# Altium schematic sheet AFE_BQ-Chip.SchDoc
size A4
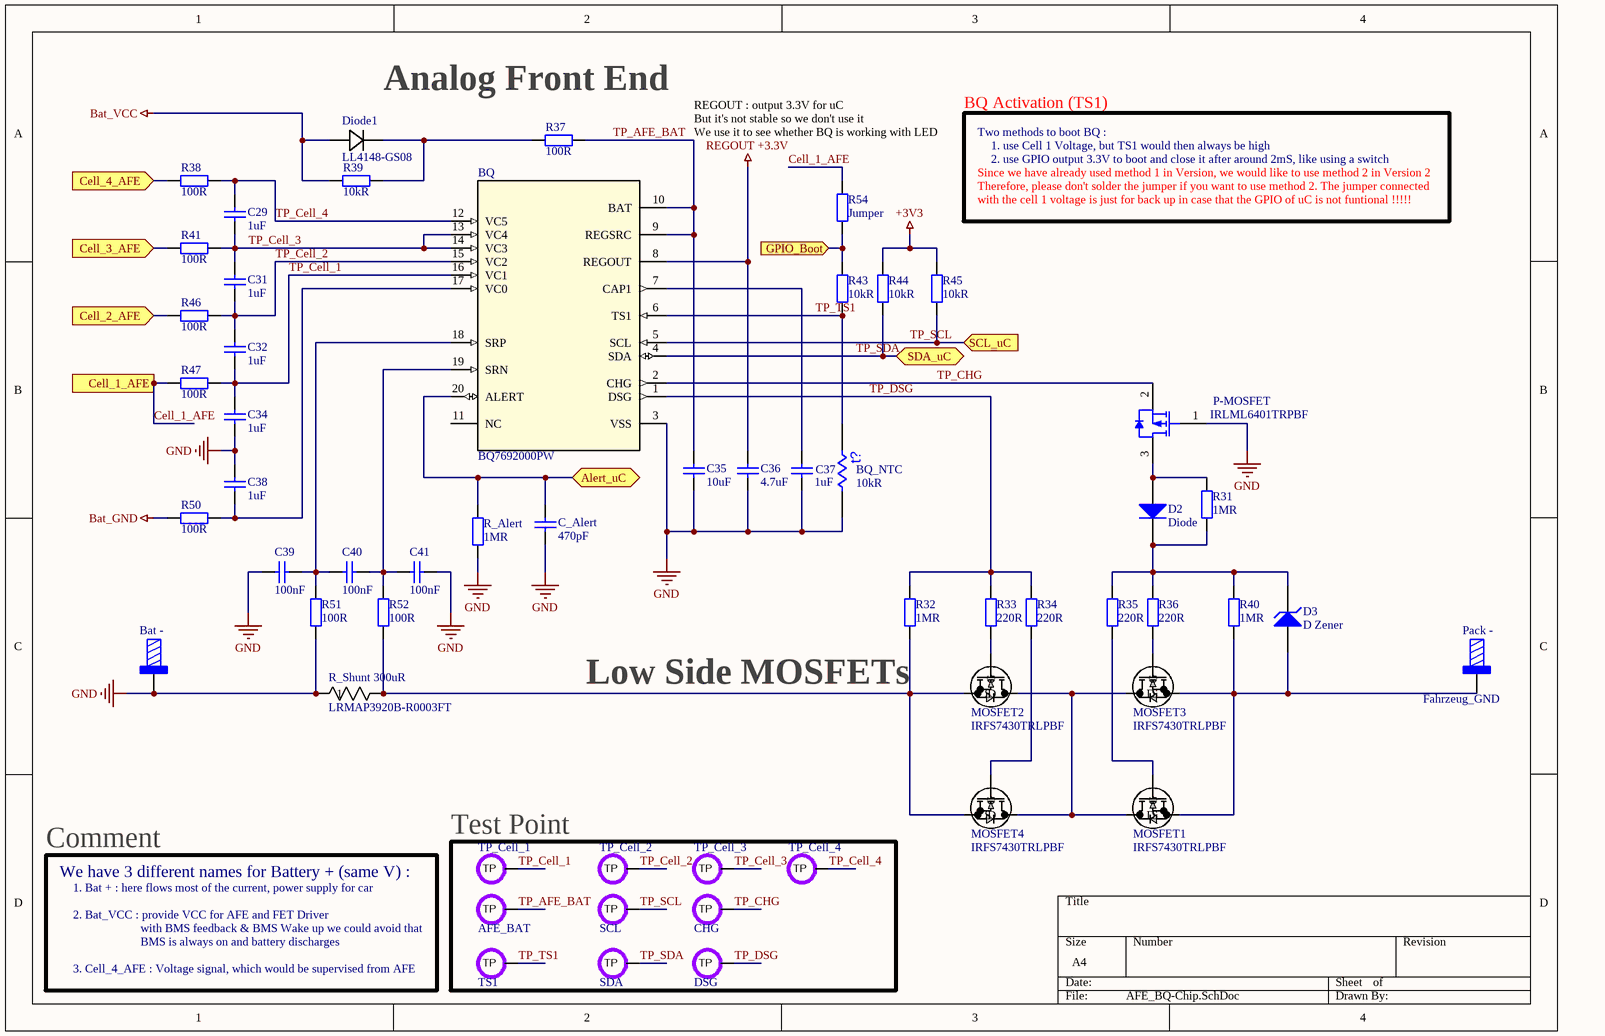
[diagram p0: AFE_BQ-Chip.SchDoc]

## Parts
AFE_BAT  TP_1  [Test point]  (value not drawn)  (no BOM)
Bat_-  M4x6mm  [7461096_for chemical surfaces]  (value not drawn)
BQ  BQ7692000PW  [PW0020A_N]
BQ_NTC  10kR  [J1-0603]
C29  1uF  [1608[0603]]
C31  1uF  [1608[0603]]
C32  1uF  [1608[0603]]
C34  1uF  [1608[0603]]
C35  10uF  [1608[0603]]
C36  4.7uF  [1608[0603]]
C37  1uF  [1608[0603]]
C38  1uF  [1608[0603]]
C39  100nF  [1608[0603]]
C40  100nF  [1608[0603]]
C41  100nF  [1608[0603]]
C_Alert  470pF  [1608[0603]]
CHG  TP_1  [Test point]  (value not drawn)  (no BOM)
D2  Diode  [SMB]
D3  D Zener  [SMB]
Diode1  LL4148-GS08  [MELF_SOD-80_VIS]
DSG  TP_1  [Test point]  (value not drawn)  (no BOM)
MOSFET1  IRFS7430TRLPBF  [D2PAK_TO-263AB_INF-M]
MOSFET2  IRFS7430TRLPBF  [D2PAK_TO-263AB_INF-M]
MOSFET3  IRFS7430TRLPBF  [D2PAK_TO-263AB_INF-M]
MOSFET4  IRFS7430TRLPBF  [D2PAK_TO-263AB_INF-M]
P-MOSFET  IRLML6401TRPBF  [INTR-SOT-23-3_V]
Pack_-  Fahrzeug_GND  [7461096_for chemical surfaces]
R31  1MR  [J1-0603]
R32  1MR  [J1-0603]
R33  220R  [J1-0603]
R34  220R  [J1-0603]
R35  220R  [J1-0603]
R36  220R  [J1-0603]
R37  100R  [J1-0603]
R38  100R  [J1-0603]
R39  10kR  [J1-0603]
R40  1MR  [J1-0603]
R41  100R  [J1-0603]
R43  10kR  [J1-0603]
R44  10kR  [J1-0603]
R45  10kR  [J1-0603]
R46  100R  [J1-0603]
R47  100R  [J1-0603]
R50  100R  [J1-0603]
R51  100R  [J1-0603]
R52  100R  [J1-0603]
R54  Jumper  [J1-0603]
R_Alert  1MR  [J1-0603]
R_Shunt_300uR  LRMAP3920B-R0003FT  [RES_LRMAP3920B-R0003FT_WEL]
SCL  TP_1  [Test point]  (value not drawn)  (no BOM)
SDA  TP_1  [Test point]  (value not drawn)  (no BOM)
TP_Cell_1  TP_1  [Test point]  (value not drawn)  (no BOM)
TP_Cell_2  TP_1  [Test point]  (value not drawn)  (no BOM)
TP_Cell_3  TP_1  [Test point]  (value not drawn)  (no BOM)
TP_Cell_4  TP_1  [Test point]  (value not drawn)  (no BOM)
TS1  TP_1  [Test point]  (value not drawn)  (no BOM)

## Blocks framed on the sheet
Test Point: AFE_BAT CHG DSG SCL SDA TP_Cell_1-TP_Cell_4 TS1

## Ports
Alert_uC (bidir), Cell_1_AFE (in), Cell_2_AFE (in), Cell_3_AFE (in), Cell_4_AFE (in), GPIO_Boot (in), SCL_uC (in), SDA_uC (bidir)

## Nets
+3V3: R44.1 R45.1
Bat_GND: R50.2
Bat_VCC: Diode1.2 R39.2
GND: Bat_-.1 BQ.3(VSS) BQ_NTC.2 C34.1 C35.2 C36.2 C37.2 C38.1 C39.2 C41.1 C_Alert.2 P-MOSFET.1(GATE) R51.2 R_Alert.2 R_Shunt_300uR.1
REGOUT +3.3V: BQ.8(REGOUT) C36.1
Alert_uC: BQ.20(ALERT) C_Alert.1 R_Alert.1 ; port Alert_uC
Cell_1_AFE: R47.2 R54.2 ; port Cell_1_AFE
Cell_2_AFE: R46.2 ; port Cell_2_AFE
Cell_3_AFE: R41.2 ; port Cell_3_AFE
Cell_4_AFE: R38.2 ; port Cell_4_AFE
GPIO_Boot: R43.1 R54.1 ; port GPIO_Boot
TP_AFE_BAT: AFE_BAT.1(TP) BQ.9(REGSRC) BQ.10(BAT) C35.1 R37.1
TP_Cell_1: BQ.16(VC1) C32.1 C34.2 R47.1 TP_Cell_1.1(TP)
TP_Cell_2: BQ.15(VC2) C31.1 C32.2 R46.1 TP_Cell_2.1(TP)
TP_Cell_3: BQ.13(VC4) BQ.14(VC3) C29.1 C31.2 R41.1 TP_Cell_3.1(TP)
TP_Cell_4: BQ.12(VC5) C29.2 R38.1 TP_Cell_4.1(TP)
TP_CHG: BQ.2(CHG) CHG.1(TP) P-MOSFET.2(SOURCE)
TP_DSG: BQ.1(DSG) DSG.1(TP) R32.1 R33.1 R34.1
TP_SCL: BQ.5(SCL) R45.2 SCL.1(TP) ; port SCL_uC
TP_SDA: BQ.4(SDA) R44.2 SDA.1(TP) ; port SDA_uC
TP_TS1: BQ.6(TS1) BQ_NTC.1 R43.2 TS1.1(TP)
NetBQ_7: BQ.7(CAP1) C37.1
NetBQ_17: BQ.17(VC0) C38.2 R50.1
NetBQ_18: BQ.18(SRP) C39.1 C40.2 R51.1
NetBQ_19: BQ.19(SRN) C40.1 C41.2 R52.1
NetD2_1: D2.1(A) P-MOSFET.3(DRAIN) R31.1
NetD2_2: D2.2(K) D3.2(K) R31.2 R35.1 R36.1 R40.1
NetD3_1: D3.1(A) MOSFET1.3(S) MOSFET3.3(S) Pack_-.1 R40.2
NetDiode1_1: Diode1.1 R37.2 R39.1
NetMOSFET1_1: MOSFET1.1(G) R35.2
NetMOSFET1_2: MOSFET1.2(D) MOSFET2.2(D) MOSFET3.2(D) MOSFET4.2(D)
NetMOSFET2_1: MOSFET2.1(G) R33.2
NetMOSFET2_3: MOSFET2.3(S) MOSFET4.3(S) R32.2 R52.2 R_Shunt_300uR.2
NetMOSFET3_1: MOSFET3.1(G) R36.2
NetMOSFET4_1: MOSFET4.1(G) R34.2

Not connected (* = marked no-connect by the designer): BQ 11(NC)

## Notes on the sheet
- Analog Front End
- REGOUT : output 3.3V for uC
- BQ Activation (TS1)
- But it's not stable so we don't use it
- We use it to see whether BQ is working with LED
- Two methods to boot BQ :
- Since we have already used method 1 in Version, we would like to use method 2 in Version 2
- 1. use Cell 1 Voltage, but TS1 would then always be high
- 2. use GPIO output 3.3V to boot and close it after around 2mS, like using a switch
- Therefore, please don't solder the jumper if you want to use method 2. The jumper connected
- with the cell 1 voltage is just for back up in case that the GPIO of uC is not funtional !!!!!
- (near R32) Low Side MOSFETs
- Comment
- We have 3 different names for Battery + (same V) :
- 1. Bat + : here flows most of the current, power supply for car
- 2. Bat_VCC : provide VCC for AFE and FET Driver
- (near TS1) 3. Cell_4_AFE : Voltage signal, which would be supervised from AFE
- with BMS feedback & BMS Wake up we could avoid that
- BMS is always on and battery discharges
- (in symbol Res Thermal) t?

## Library data of the parts
AFE_BAT CHG DSG SCL SDA TP_Cell_1-TP_Cell_4 TS1 = Test point
Bat_- Pack_- = 7461096: WP-SHFU Press-Fit with External thread, full plain, 7x7mm, 9 pins, M4x6mm, 130A; Pin Number: 9; Thread Length: 6mm; Thread: M4; Surface: Tin; ComponentLink1Description: Manufacturer; ComponentLink1URL: http://www.we-online.de; ComponentLink2Description: Datasheet; ComponentLink2URL: https://katalog.we-online.com/em/datasheet/7461096.pdf; Operating Temperature: -55 to +150degC; Height: 9mm; Material: Brass; Part Number: 7461096; Packaging: Bulk; Mounting Technology: Press-Fit; Rated Current: 130A; Publisher: Wurth Elektronik; Published Date: September 2019; Size: 7x7mm
BQ = BQ7692000PW: AFE Cell battery monitor; PartNumber: BQ7692000PWR; Manufacturer: Texas Instruments; RefDes: RefDes; Type: DEV; Value: Value; Copyright: Copyright (C) 2018 Accelerated Designs. All rights reserved
BQ_NTC = Res Thermal: Thermistor; Published: 24-Mar-1999; LatestRevisionDate: 29-May-2009; LatestRevisionNote: IPC-7351 Footprint Added.; PackageVersion: Mar-2003; PackageReference: 6-0805; Publisher: Altium Limited; PackageDescription: Chip Resistor 0805 Case Size; Code_IPC: RESC2012
C29 C31 C32 C34-C41 C_Alert = Cap: Capacitor; Value: 220nF; Published: 8-Jun-2000; LatestRevisionDate: 17-Jul-2002; LatestRevisionNote: Re-released for DXP Platform.; PackageReference: RAD-0.3; Publisher: Altium Limited; PackageDescription: Radial Cap, Thru-Hole; 2 Leads; 0.3 in Pin Spacing
D2 = Diode: Default Diode; Published: 8-Jun-2000; LatestRevisionDate: 17-Jul-2002; LatestRevisionNote: Re-released for DXP Platform.; PackageVersion: Sep-1996; PackageReference: SMC; Publisher: Altium Limited; PackageDescription: DO-214-AB/SMC; 2 C-Bend Leads; Body 7.9 x 5.9 mm, inc. leads (LxW); Code_JEDEC: DO-214-AB
D3 = D Zener: Zener Diode; Published: 8-Jun-2000; LatestRevisionDate: 17-Jul-2002; LatestRevisionNote: Re-released for DXP Platform.; PackageReference: DIODE-0.7; Publisher: Altium Limited; PackageDescription: Diode, Thru-Hole; 2 Leads; 0.7 in Pin Spacing
Diode1 = LL4148-GS08: No Description Available; Vendor: Vishay; Built_By: EMA_UL_Team; SourceLibrary: Vishay_2020-02-10; Manufacturer_Part_Number: LL4148-GS08; Copyright: Copyright (C) 2018 Accelerated Designs. All rights reserved; RefDes: RefDes; Type: DEV
MOSFET1-MOSFET4 = IRFS7430TRLPBF: No Description Available; Vendor: Infineon; Built_By: EMA_Cory; SourceLibrary: Infineon_2020-06-10; Datasheet: https://www.infineon.com/dgdl/Infineon-IRFS7430-DS-v01_00-EN.pdf?fileId=5546d462576f3475015792dbfbd6000d; Manufacturer_Part_Number: IRFS7430TRLPBF; Copyright: Copyright (C) 2018 Accelerated Designs. All rights reserved; RefDes: RefDes; Type: DEV
P-MOSFET = CMP-2000-04986-1: HEXFET(R) Power P-Channel MOSFET, -12 V, -4.3 A, -55 to 150 degC, 3-Pin SOT-23, RoHS, Tape and Reel; Manufacturer: International Rectifier; Maximum Drain Source Voltage: -12V; Maximum Gate Source Voltage: ±8V; Maximum Power Dissipation: 1.3W; Channel Mode: Enhancement; Typical Input Capacitance @ Vds: 830pF@-10V; Channel Type: P; Maximum Drain Source Resistance: 0.085Ω; Typical TurnOff Delay Time: 32ns; Forward Transconductance: 8.6S; Typical Turn On Delay Time: 11ns; Typical Gate Charge @ Vgs: 10nC@-5V; Number of Elements per Chip: 1; Forward Diode Voltage: -1.2V; Configuration: Single; Maximum Continuous Drain Current: -3.4A; Package Reference: SOT-23-3; Package Type: Micro3; Pin Count: 3; Series: HEXFETSeries; Maximum Operating Temperature: +150degC; Length: 3.04mm; Manufacturer URL: http://internationalrectifier.com/; Width: 1.4mm; Category: PowerMOSFET; Dimensions: 3.04x1.40x1.02mm; Minimum Operating Temperature: -55degC; Height: 1.02mm; Datasheet Version: May-10; Mounting Type: SurfaceMount; Datasheet URL: http://datasheet.octopart.com/IRLML6401TRPBF-International-Rectifier-datasheet-10898914.pdf; Package Description: 3-Pin Small Outline Transistor, Body 2.92 x 1.3 mm, Pitch 0.95 mm; Operating Temperature Range: -55to+150degC
R31-R38 R40 R41 R46 R47 R50-R52 R54 R_Alert = Res2: Resistor; Value: 10kR; Published: 8-Jun-2000; LatestRevisionDate: 17-Jul-2002; LatestRevisionNote: Re-released for DXP Platform.; PackageReference: AXIAL-0.4; Publisher: Altium Limited; PackageDescription: Axial Device, Thru-Hole; 2 Leads; 0.4 in Pin Spacing
R39 R43-R45 = Res2: Resistor; Published: 8-Jun-2000; LatestRevisionDate: 17-Jul-2002; LatestRevisionNote: Re-released for DXP Platform.; PackageReference: AXIAL-0.4; Publisher: Altium Limited; PackageDescription: Axial Device, Thru-Hole; 2 Leads; 0.4 in Pin Spacing; Value: 10kR
R_Shunt_300uR = LRMAP3920B-R0003FT: No Description Available; Vendor: Welwyn; Built_By: EMA_Anthony; SourceLibrary: Welwyn_2019-11-05; Copyright: Copyright (C) 2018 Accelerated Designs. All rights reserved; Manufacturer_Part_Number: LRMAP3920B-R0003FT; RefDes: RefDes; Type: DEV